# Altium schematic sheet pwr_brk.SchDoc
size A4
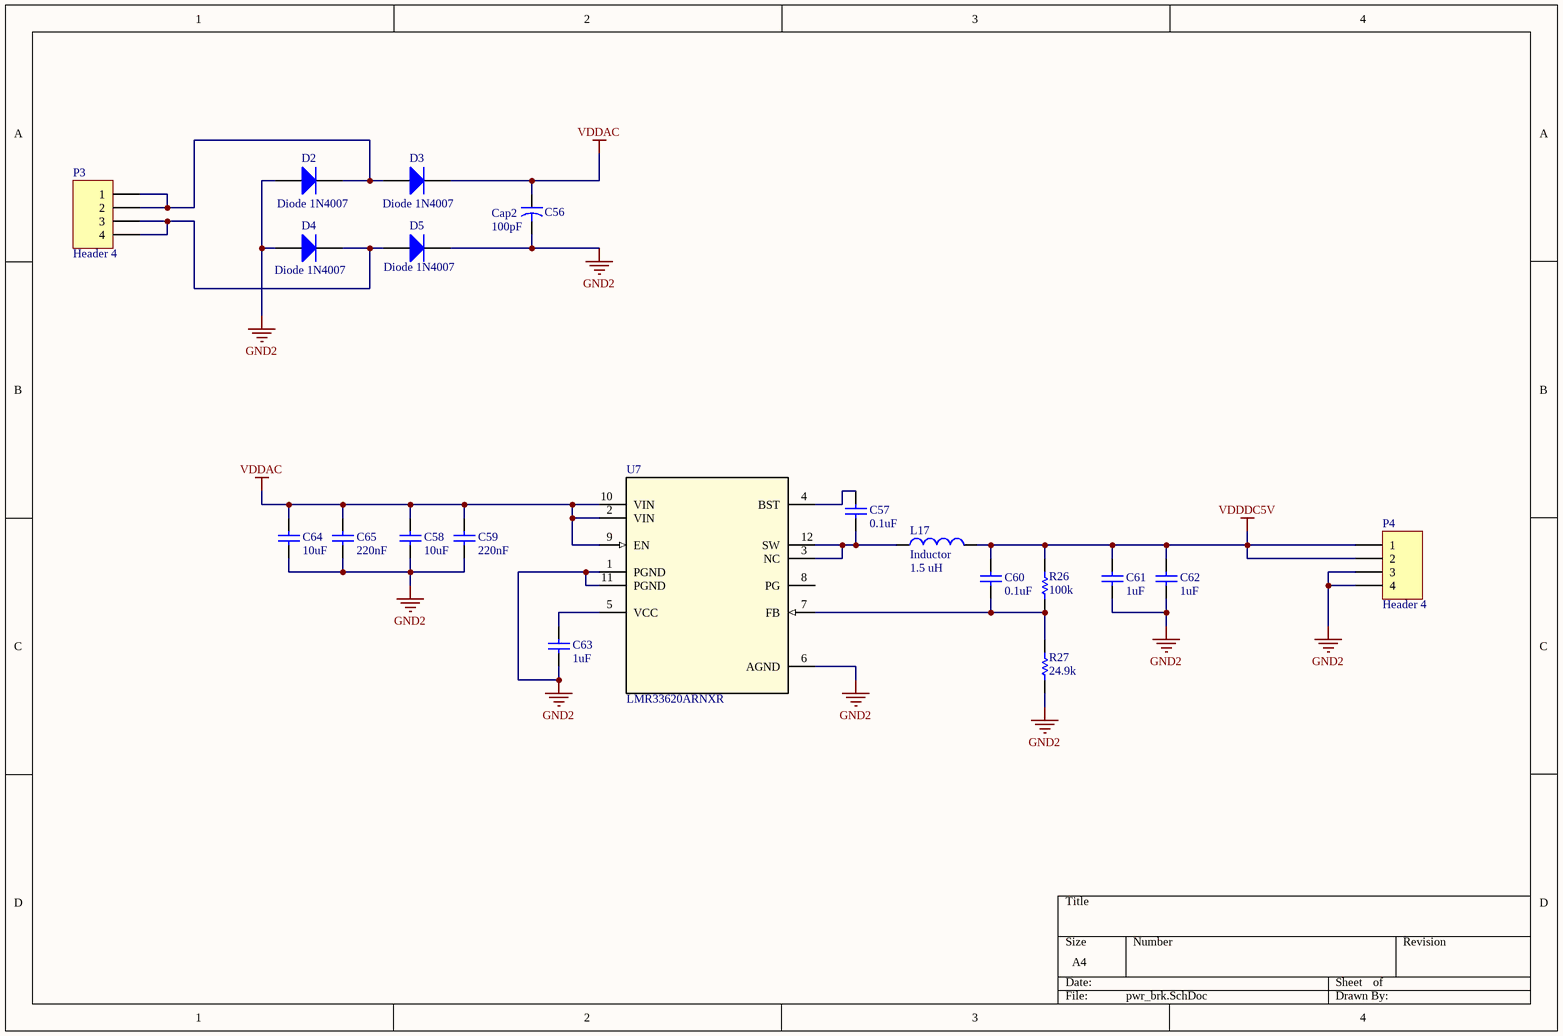
[diagram p0: pwr_brk.SchDoc]

## Parts
C56  Cap2  value 100pF  [CAPR5-4X5]
C57  value 0.1uF  [C_0402]
C58  value 10uF  [CAPC1608X05N]
C59  value 220nF  [C_0402]
C60  value 0.1uF  [C_0402]
C61  value 1uF  [CAPC1608X05N]
C62  value 1uF  [CAPC1608X05N]
C63  value 1uF  [C_0402]
C64  value 10uF  [CAPC1608X05N]
C65  value 220nF  [C_0402]
D2  Diode 1N4007  [DO-41]
D3  Diode 1N4007  [DO-41]
D4  Diode 1N4007  [DO-41]
D5  Diode 1N4007  [DO-41]
L17  Inductor  value 1.5 uH  [INDC2016X10N]
P3  Header 4  [HDR1X4]
P4  Header 4  [HDR1X4]
R26  Res1  [R_0402]  (value not drawn)
R27  Res1  [R_0402]  (value not drawn)
U7  LMR33620ARNXR  [RNX0012B]

## Nets
GND2: C56.2 C58.1 C59.1 C61.1 C62.1 C63.1 C64.1 C65.1 D2.1(A) D4.1(A) D5.2(K) P4.3 P4.4 R27.2 U7.1(PGND) U7.6(AGND) U7.11(PGND)
VDDAC: C56.1 C58.2 C59.2 C64.2 C65.2 D3.2(K) U7.2(VIN) U7.9(EN) U7.10(VIN)
VDDDC5V: C60.2 C61.2 C62.2 L17.2 P4.1 P4.2 R26.1
NetC57_1: C57.1 L17.1 U7.3(NC) U7.12(SW)
NetC57_2: C57.2 U7.4(BST)
NetC60_1: C60.1 R26.2 R27.1 U7.7(FB)
NetC63_2: C63.2 U7.5(VCC)
NetD2_2: D2.2(K) D3.1(A) P3.1 P3.2
NetD4_2: D4.2(K) D5.1(A) P3.3 P3.4

Not connected (* = marked no-connect by the designer): U7 8(PG)

## Notes on the sheet
- (in symbol Res1) 100k; 24.9k

## Library data of the parts
C56 = Cap2: Capacitor; Published: 23-Sep-2002; PackageReference: CAPR5-4X5; Publisher: Altium Limited; PackageDescription: Capacitor; 2 Leads
C57-C65 = Cap
D2-D5 = Diode 1N4007: 1 Amp General Purpose Rectifier; Published: 8-Jun-2000; LatestRevisionDate: 17-Jul-2002; LatestRevisionNote: Re-released for DXP Platform.; DatasheetVersion: 1998; PackageVersion: Aug-1999; PackageReference: DO-41; Publisher: Altium Limited; PackageDescription: Diode, Axial; Body 5.2 x 2.7 mm (LxDia. max), Lead Dia. 0.86 mm (max); Code_JEDEC: DO-204-AL; ComponentLink1Description: Manufacturer Link; ComponentLink1URL: http://www.fairchildsemi.com/; ComponentLink2Description: Datasheet; ComponentLink2URL: http://www.fairchildsemi.com/ds/1N%2F1N4001.pdf
L17 = Inductor: Code_IEC: 1005; Published: 8-Jun-2000; LatestRevisionDate: 29-May-2009; LatestRevisionNote: IPC-7351 Footprint Added.; PackageReference: 0402-A; Publisher: Altium Limited; PackageDescription: Chip Inductor; Code_JEITA: 0402
P3 P4 = Header 4: Header, 4-Pin; LatestRevisionDate: 17-Jul-2002; LatestRevisionNote: Re-released for DXP Platform.; Publisher: Altium Limited
R26 R27 = Res1: Resistor
U7 = LMR33620ARNXR: Imported; Manufacturer: Texas Instruments; PartNumber: LMR33620ARNXR; RefDes: RefDes; TYPE: TYPE; Value: Value